# EAGLE board faout (EAGLE 7.1.0)
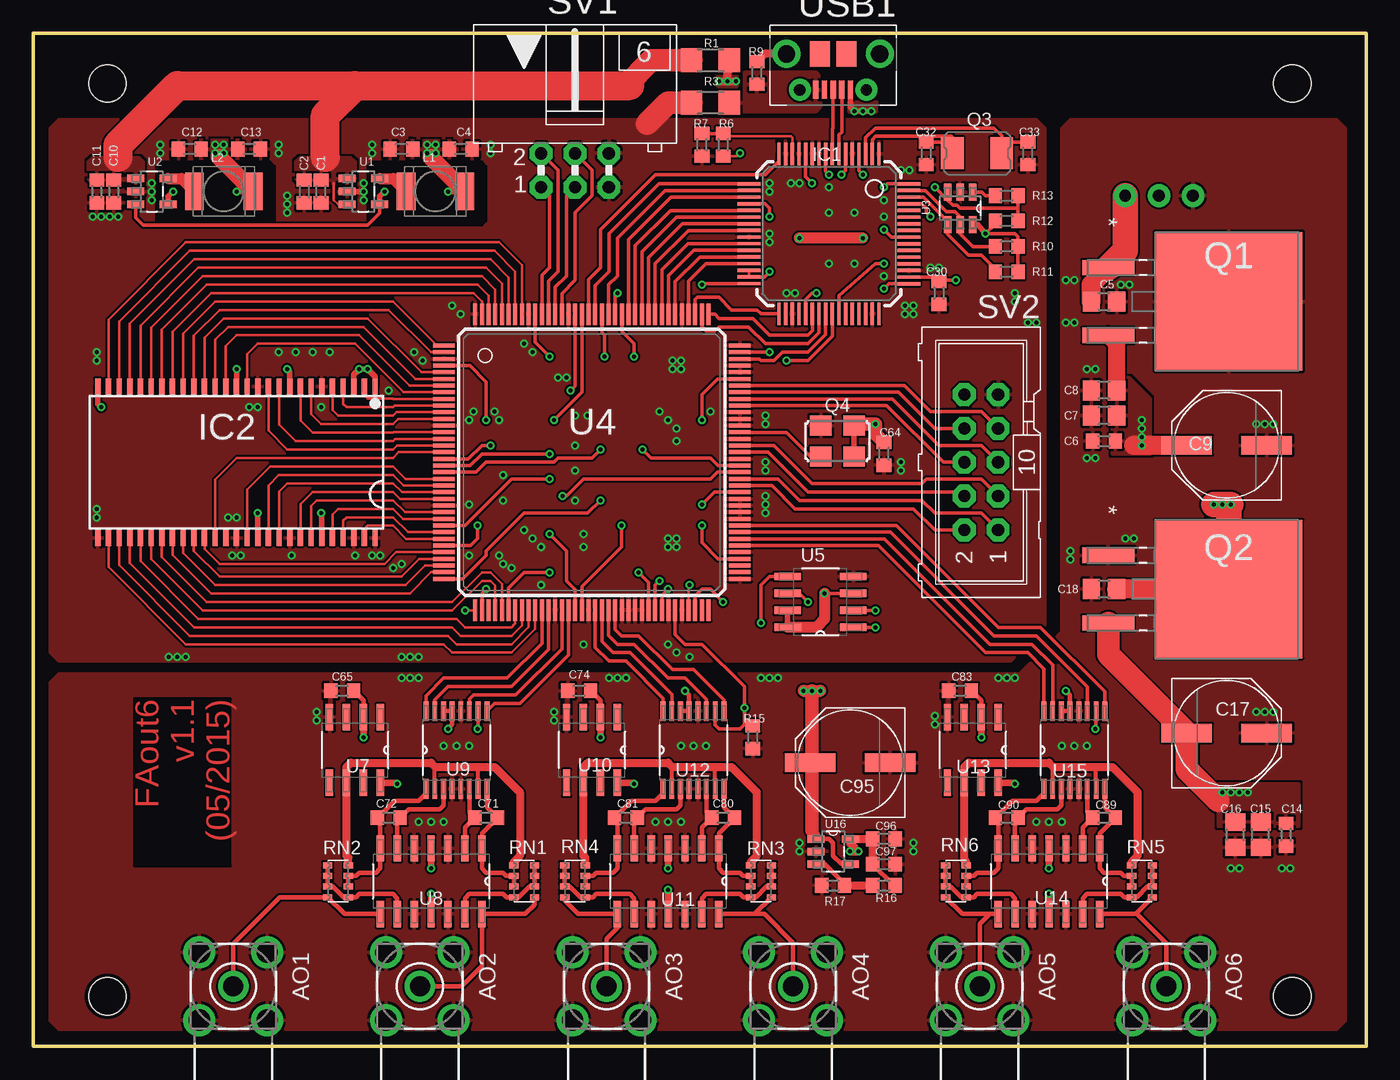
[diagram p1: board, top side]
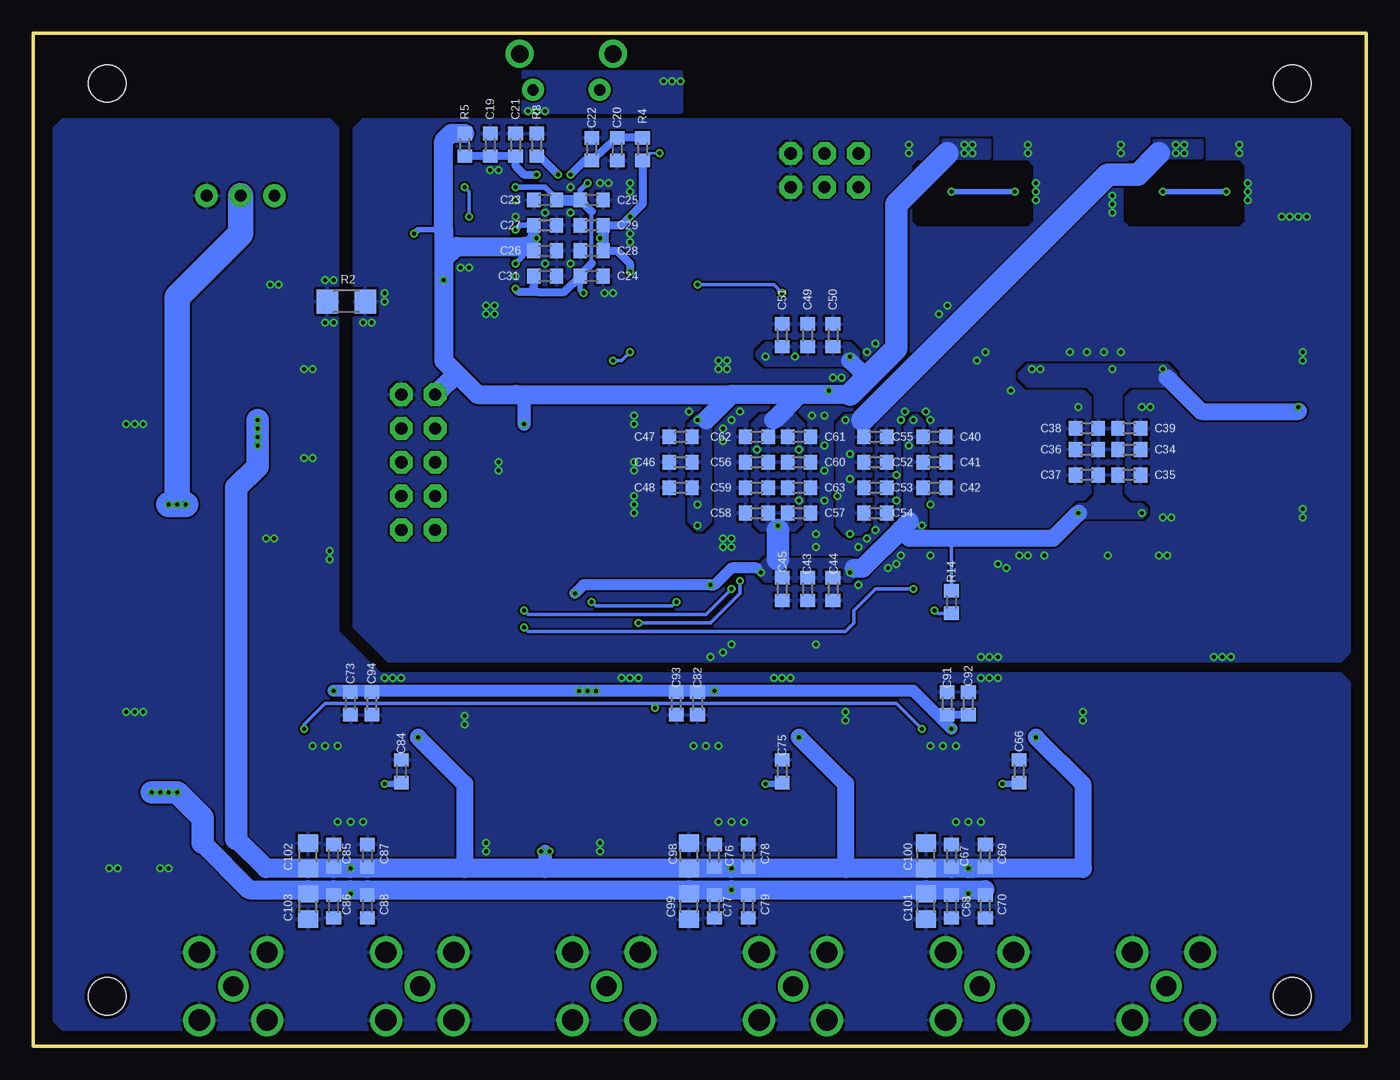
[diagram p2: board, bottom side, seen from below]

Size 100 x 76 mm. Coordinates in mm from the lower left corner, seen from the top.
Outline: 0,0 100,0 100,76 0,76 0,0
Copper layers (1*16): Top 0.035mm / dielectric 1.5mm / Bottom 0.035mm
Design rules "PCB-POOL Standard *": minimum track width 0.15mm, minimum drill 0.3mm, track to track 0.15mm, track to pad 0.15mm, pad to pad 0.15mm, via to via 0.15mm, smd to smd 0.15mm, copper to edge 0.3mm, drill to drill 0.2mm, minimum pad ring 0.4mm, minimum via ring 0.15mm, stop-mask expansion 0.075mm, vias tented up to drill 0.3mm, thermal gap 0.2mm
Net classes: 1 spaceing: clearance 0.5 mm
Holes 2.8 mm at 5.55,3.75 94.45,3.75 5.55,72.25 94.45,72.25

## Footprints (pad centres in the part's own frame; a part is rotated, then mirrored left to right if it is on the bottom)
BU-SMA-H = drill 1.5: 1 0,0 | drill 1.6: 2 -2.55,2.55; 3 2.55,2.55; 4 2.55,-2.55; 5 -2.55,-2.55
R0603 = smd 1 x 1.1: 1 -0.85,0; 2 0.85,0
R0805 = smd 1.3 x 1.5: 1 -0.95,0; 2 0.95,0
PANASONIC_E = smd 3.8 x 1.4: + 3,0; - -3,0
TQFP64-12X12 = smd 0.25 x 1.7: 1 -3.75,-6; 2 -3.25,-6; 3 -2.75,-6; 4 -2.25,-6; 5 -1.75,-6; 6 -1.25,-6; 7 -0.75,-6; 8 -0.25,-6; 9 0.25,-6; 10 0.75,-6; 11 1.25,-6; 12 1.75,-6; 13 2.25,-6; 14 2.75,-6; 15 3.25,-6; 16 3.75,-6; 33 3.75,6; 34 3.25,6; 35 2.75,6; 36 2.25,6; 37 1.75,6; 38 1.25,6; 39 0.75,6; 40 0.25,6; 41 -0.25,6; 42 -0.75,6; 43 -1.25,6; 44 -1.75,6; 45 -2.25,6; 46 -2.75,6; 47 -3.25,6; 48 -3.75,6 | smd 1.7 x 0.25: 17 6,-3.75; 18 6,-3.25; 19 6,-2.75; 20 6,-2.25; 21 6,-1.75; 22 6,-1.25; 23 6,-0.75; 24 6,-0.25; 25 6,0.25; 26 6,0.747; 27 6,1.247; 28 6,1.747; 29 6,2.247; 30 6,2.747; 31 6,3.247; 32 6,3.747; 49 -6,3.75; 50 -6,3.25; 51 -6,2.75; 52 -6,2.25; 53 -6,1.75; 54 -6,1.25; 55 -6,0.75; 56 -6,0.25; 57 -6,-0.25; 58 -6,-0.75; 59 -6,-1.25; 60 -6,-1.75; 61 -6,-2.25; 62 -6,-2.75; 63 -6,-3.25; 64 -6,-3.75
TSOP54-400 = smd 0.4 x 1.2: 1 -10.4,-5.68; 2 -9.6,-5.68; 3 -8.8,-5.68; 4 -8,-5.68; 5 -7.2,-5.68; 6 -6.4,-5.68; 7 -5.6,-5.68; 8 -4.8,-5.68; 9 -4,-5.68; 10 -3.2,-5.68; 11 -2.4,-5.68; 12 -1.6,-5.68; 13 -0.8,-5.68; 14 0,-5.68; 15 0.8,-5.68; 16 1.6,-5.68; 17 2.4,-5.68; 18 3.2,-5.68; 19 4,-5.68; 20 4.8,-5.68; 21 5.6,-5.68; 22 6.4,-5.68; 23 7.2,-5.68; 24 8,-5.68; 25 8.8,-5.68; 26 9.6,-5.68; 27 10.4,-5.68; 28 10.4,5.68; 29 9.6,5.68; 30 8.8,5.68; 31 8,5.68; 32 7.2,5.68; 33 6.4,5.68; 34 5.6,5.68; 35 4.8,5.68; 36 4,5.68; 37 3.2,5.68; 38 2.4,5.68; 39 1.6,5.68; 40 0.8,5.68; 41 0,5.68; 42 -0.8,5.68; 43 -1.6,5.68; 44 -2.4,5.68; 45 -3.2,5.68; 46 -4,5.68; 47 -4.8,5.68; 48 -5.6,5.68; 49 -6.4,5.68; 50 -7.2,5.68; 51 -8,5.68; 52 -8.8,5.68; 53 -9.6,5.68; 54 -10.4,5.68
L5038P = smd 1.4 x 2.8: 1 -2.2,0; 2 2.2,0
TE_CONN_MTE_HEADER3_R = drill 0.89: P$1 -2.54,0; P$2 0,0; P$3 2.54,0
TO254P1524X460-3N = smd 1.143 x 3.912: 1 -2.54,-8.89; 3 2.54,-8.89 | smd 10.389 x 11.049: 2 0,0.152
TXC_QUARTZ_7A = smd 1.7 x 2.4: 1 -1.85,0; 2 1.85,0
ASF = smd 1.6 x 1.5: 1 -1.25,-1.15; 2 1.25,-1.15; 3 1.25,1.15; 4 -1.25,1.15
R1206 = smd 1.6 x 1.803: 1 -1.422,0; 2 1.422,0
EXBV8V = smd 0.45 x 0.7: 1 -1.2,-0.775; 2 -0.4,-0.775; 3 0.4,-0.775; 4 1.2,-0.775; 5 1.2,0.775; 6 0.4,0.775; 7 -0.4,0.775; 8 -1.2,0.775
ML6L = drill 0.914 octagon: 1 -2.54,-1.27; 2 -2.54,1.27; 3 0,-1.27; 4 0,1.27; 5 2.54,-1.27; 6 2.54,1.27
ML10 = drill 0.914 octagon: 1 -5.08,-1.27; 2 -5.08,1.27; 3 -2.54,-1.27; 4 -2.54,1.27; 5 0,-1.27; 6 0,1.27; 7 2.54,-1.27; 8 2.54,1.27; 9 5.08,-1.27; 10 5.08,1.27
SOT95P284X122-5N = smd 1.27 x 0.559: 1 -1.219,0.965; 2 -1.219,0; 3 -1.219,-0.965; 4 1.219,-0.965; 5 1.219,0.965
SOT95P280X145-6N = smd 1.27 x 0.559: 1 -1.219,0.94; 2 -1.219,0; 3 -1.219,-0.94; 4 1.219,-0.94; 5 1.219,0; 6 1.219,0.94
TQ144 = smd 1.6 x 0.3: 1 -11.1,8.75; 2 -11.1,8.25; 3 -11.1,7.75; 4 -11.1,7.25; 5 -11.1,6.75; 6 -11.1,6.25; 7 -11.1,5.75; 8 -11.1,5.25; 9 -11.1,4.75; 10 -11.1,4.25; 11 -11.1,3.75; 12 -11.1,3.25; 13 -11.1,2.75; 14 -11.1,2.25; 15 -11.1,1.75; 16 -11.1,1.25; 17 -11.1,0.75; 18 -11.1,0.25; 19 -11.1,-0.25; 20 -11.1,-0.75; 21 -11.1,-1.25; 22 -11.1,-1.75; 23 -11.1,-2.25; 24 -11.1,-2.75; 25 -11.1,-3.25; 26 -11.1,-3.75; 27 -11.1,-4.25; 28 -11.1,-4.75; 29 -11.1,-5.25; 30 -11.1,-5.75; 31 -11.1,-6.25; 32 -11.1,-6.75; 33 -11.1,-7.25; 34 -11.1,-7.75; 35 -11.1,-8.25; 36 -11.1,-8.75; 73 11.1,-8.75; 74 11.1,-8.25; 75 11.1,-7.75; 76 11.1,-7.25; 77 11.1,-6.75; 78 11.1,-6.25; 79 11.1,-5.75; 80 11.1,-5.25; 81 11.1,-4.75; 82 11.1,-4.25; 83 11.1,-3.75; 84 11.1,-3.25; 85 11.1,-2.75; 86 11.1,-2.25; 87 11.1,-1.75; 88 11.1,-1.25; 89 11.1,-0.75; 90 11.1,-0.25; 91 11.1,0.25; 92 11.1,0.75; 93 11.1,1.25; 94 11.1,1.75; 95 11.1,2.25; 96 11.1,2.75; 97 11.1,3.25; 98 11.1,3.75; 99 11.1,4.25; 100 11.1,4.75; 101 11.1,5.25; 102 11.1,5.75; 103 11.1,6.25; 104 11.1,6.75; 105 11.1,7.25; 106 11.1,7.75; 107 11.1,8.25; 108 11.1,8.75 | smd 0.3 x 1.6: 37 -8.75,-11.1; 38 -8.25,-11.1; 39 -7.75,-11.1; 40 -7.25,-11.1; 41 -6.75,-11.1; 42 -6.25,-11.1; 43 -5.75,-11.1; 44 -5.25,-11.1; 45 -4.75,-11.1; 46 -4.25,-11.1; 47 -3.75,-11.1; 48 -3.25,-11.1; 49 -2.75,-11.1; 50 -2.25,-11.1; 51 -1.75,-11.1; 52 -1.25,-11.1; 53 -0.75,-11.1; 54 -0.25,-11.1; 55 0.25,-11.1; 56 0.75,-11.1; 57 1.25,-11.1; 58 1.75,-11.1; 59 2.25,-11.1; 60 2.75,-11.1; 61 3.25,-11.1; 62 3.75,-11.1; 63 4.25,-11.1; 64 4.75,-11.1; 65 5.25,-11.1; 66 5.75,-11.1; 67 6.25,-11.1; 68 6.75,-11.1; 69 7.25,-11.1; 70 7.75,-11.1; 71 8.25,-11.1; 72 8.75,-11.1; 109 8.75,11.1; 110 8.25,11.1; 111 7.75,11.1; 112 7.25,11.1; 113 6.75,11.1; 114 6.25,11.1; 115 5.75,11.1; 116 5.25,11.1; 117 4.75,11.1; 118 4.25,11.1; 119 3.75,11.1; 120 3.25,11.1; 121 2.75,11.1; 122 2.25,11.1; 123 1.75,11.1; 124 1.25,11.1; 125 0.75,11.1; 126 0.25,11.1; 127 -0.25,11.1; 128 -0.75,11.1; 129 -1.25,11.1; 130 -1.75,11.1; 131 -2.25,11.1; 132 -2.75,11.1; 133 -3.25,11.1; 134 -3.75,11.1; 135 -4.25,11.1; 136 -4.75,11.1; 137 -5.25,11.1; 138 -5.75,11.1; 139 -6.25,11.1; 140 -6.75,11.1; 141 -7.25,11.1; 142 -7.75,11.1; 143 -8.25,11.1; 144 -8.75,11.1
SOIC127P600X175-8N = smd 1.981 x 0.559: 1 -2.464,1.905; 2 -2.464,0.635; 3 -2.464,-0.635; 4 -2.464,-1.905; 5 2.464,-1.905; 6 2.464,-0.635; 7 2.464,0.635; 8 2.464,1.905
SOIC127P600X175-14N = smd 1.981 x 0.559: 1 -2.464,3.81; 2 -2.464,2.54; 3 -2.464,1.27; 4 -2.464,0; 5 -2.464,-1.27; 6 -2.464,-2.54; 7 -2.464,-3.81; 8 2.464,-3.81; 9 2.464,-2.54; 10 2.464,-1.27; 11 2.464,0; 12 2.464,1.27; 13 2.464,2.54; 14 2.464,3.81
SOP65P640X120-16N = smd 1.473 x 0.356: 1 -2.921,2.286; 2 -2.921,1.626; 3 -2.921,0.965; 4 -2.921,0.33; 5 -2.921,-0.33; 6 -2.921,-0.965; 7 -2.921,-1.626; 8 -2.921,-2.286; 9 2.921,-2.286; 10 2.921,-1.626; 11 2.921,-0.965; 12 2.921,-0.33; 13 2.921,0.33; 14 2.921,0.965; 15 2.921,1.626; 16 2.921,2.286
SOT95P300X120-5N = smd 1.27 x 0.559: 1 -1.295,0.94; 2 -1.295,0; 3 -1.295,-0.94; 4 1.295,-0.94; 5 1.295,0.94
MOLEX_105017-0001 = smd 0.4 x 1.35: 1 -1.3,0; 2 -0.65,0; 3 0,0; 4 0.65,0; 5 1.3,0 | drill 0.85 pad 1.45: M1 -2.5,0; M2 2.5,0 | drill 1.3 pad 1.9: M3 -3.5,-2.7; M6 3.5,-2.7 | smd 1.5 x 1.9: M4 -1,-2.7; M5 1,-2.7

## Placement (x,y rotation side)
AO1  BU-SMA  [BU-SMA-H]  15,4.5 270 top
AO2  BU-SMA  [BU-SMA-H]  29,4.5 270 top
AO3  BU-SMA  [BU-SMA-H]  43,4.5 270 top
AO4  BU-SMA  [BU-SMA-H]  57,4.5 270 top
AO5  BU-SMA  [BU-SMA-H]  71,4.5 270 top
AO6  BU-SMA  [BU-SMA-H]  85,4.5 270 top
C1  4.7uF  [R0603]  21.59,64.14 270 top
C2  4.7uF  [R0603]  20.32,64.14 270 top
C3  4.7uF  [R0603]  27.62,67.31 180 top
C4  4.7uF  [R0603]  32.07,67.31 0 top
C5  10uF  [R0805]  80.33,55.88 0 top
C6  100nF  [R0603]  80.33,45.4 180 top
C7  10uF  [R0805]  80.33,47.31 180 top
C8  10uF  [R0805]  80.33,49.21 180 top
C9  220uF  [PANASONIC_E]  89.53,45.09 180 top
C10  4.7uF  [R0603]  6.03,64.14 270 top
C11  4.7uF  [R0603]  4.76,64.14 270 top
C12  4.7uF  [R0603]  11.75,67.31 180 top
C13  4.7uF  [R0603]  16.19,67.31 0 top
C14  100nF  [R0603]  93.98,15.88 90 top
C15  10uF  [R0805]  92.08,15.88 90 top
C16  10uF  [R0805]  90.17,15.88 90 top
C17  220uF  [PANASONIC_E]  89.53,23.5 0 top
C18  10uF  [R0805]  80.33,34.29 180 top
C19  4.7uF  [R0603]  65.72,67.63 90 bottom
C20  4.7uF  [R0603]  56.2,67.31 270 bottom
C21  100nF  [R0603]  63.82,67.63 90 bottom
C22  100nF  [R0603]  58.1,67.31 90 bottom
C23  100nF  [R0603]  61.59,63.5 180 bottom
C24  100nF  [R0603]  58.1,57.78 0 bottom
C25  100nF  [R0603]  58.1,63.5 0 bottom
C26  100nF  [R0603]  61.59,59.69 0 bottom
C27  100nF  [R0603]  61.59,61.59 0 bottom
C28  100nF  [R0603]  58.1,59.69 180 bottom
C29  100nF  [R0603]  58.1,61.59 180 bottom
C30  100nF  [R0603]  67.94,56.52 270 top
C31  4.7uF  [R0603]  61.59,57.78 0 bottom
C32  18pF  [R0603]  66.99,66.99 270 top
C33  18pF  [R0603]  74.61,66.99 270 top
C34  470nF  [R0603]  17.78,44.77 0 bottom
C35  470nF  [R0603]  17.78,42.86 0 bottom
C36  4.7uF  [R0603]  20.95,44.77 180 bottom
C37  4.7uF  [R0603]  20.95,42.86 180 bottom
C38  10nF  [R0603]  20.95,46.35 180 bottom
C39  10nF  [R0603]  17.78,46.35 0 bottom
C40  470nF  [R0603]  32.38,45.72 0 bottom
C41  470nF  [R0603]  32.38,43.81 0 bottom
C42  4.7uF  [R0603]  32.38,41.91 0 bottom
C43  470nF  [R0603]  41.91,34.29 270 bottom
C44  470nF  [R0603]  40.01,34.29 270 bottom
C45  4.7uF  [R0603]  43.81,34.29 270 bottom
C46  470nF  [R0603]  51.44,43.81 180 bottom
C47  470nF  [R0603]  51.44,45.72 180 bottom
C48  4.7uF  [R0603]  51.44,41.91 180 bottom
C49  470nF  [R0603]  41.91,53.34 90 bottom
C50  470nF  [R0603]  40.01,53.34 90 bottom
C51  4.7uF  [R0603]  43.81,53.34 90 bottom
C52  470nF  [R0603]  36.83,43.81 0 bottom
C53  4.7uF  [R0603]  36.83,41.91 0 bottom
C54  4.7uF  [R0603]  36.83,40.01 0 bottom
C55  4.7uF  [R0603]  36.83,45.72 0 bottom
C56  470nF  [R0603]  45.72,43.81 180 bottom
C57  4.7uF  [R0603]  42.55,40.01 0 bottom
C58  4.7uF  [R0603]  45.72,40.01 180 bottom
C59  4.7uF  [R0603]  45.72,41.91 180 bottom
C60  4.7uF  [R0603]  42.55,43.81 0 bottom
C61  4.7uF  [R0603]  42.55,45.72 0 bottom
C62  4.7uF  [R0603]  45.72,45.72 180 bottom
C63  4.7uF  [R0603]  42.55,41.91 0 bottom
C64  10nF  [R0603]  63.82,44.45 270 top
C65  1uF  [R0603]  23.18,26.67 180 top
C66  1uF  [R0603]  26.04,20.64 90 bottom
C67  1uF  [R0603]  31.11,14.29 90 bottom
C68  1uF  [R0603]  31.11,10.48 90 bottom
C69  100nF  [R0603]  28.57,14.29 90 bottom
C70  100nF  [R0603]  28.57,10.48 90 bottom
C71  20pF  [R0603]  33.97,17.14 180 top
C72  20pF  [R0603]  26.67,17.14 0 top
C73  10nF  [R0603]  76.2,25.72 270 bottom
C74  1uF  [R0603]  40.96,26.67 180 top
C75  1uF  [R0603]  43.81,20.64 90 bottom
C76  1uF  [R0603]  48.9,14.29 90 bottom
C77  1uF  [R0603]  48.9,10.48 90 bottom
C78  100nF  [R0603]  46.35,14.29 90 bottom
C79  100nF  [R0603]  46.35,10.48 90 bottom
C80  20pF  [R0603]  51.75,17.14 180 top
C81  20pF  [R0603]  44.45,17.14 0 top
C82  10nF  [R0603]  50.16,25.72 270 bottom
C83  1uF  [R0603]  69.53,26.67 180 top
C84  1uF  [R0603]  72.39,20.64 90 bottom
C85  1uF  [R0603]  77.47,14.29 90 bottom
C86  1uF  [R0603]  77.47,10.48 90 bottom
C87  100nF  [R0603]  74.93,14.29 90 bottom
C88  100nF  [R0603]  74.93,10.48 90 bottom
C89  20pF  [R0603]  80.33,17.14 180 top
C90  20pF  [R0603]  73.03,17.14 0 top
C91  10nF  [R0603]  31.43,25.72 90 bottom
C92  1uF  [R0603]  29.84,25.72 90 bottom
C93  1uF  [R0603]  51.75,25.72 270 bottom
C94  1uF  [R0603]  74.61,25.72 270 bottom
C95  220uF  [PANASONIC_E]  61.28,21.27 180 top
C96  10nF  [R0603]  63.82,15.56 0 top
C97  1uF  [R0603]  63.82,13.65 0 top
C98  10uF  [R0805]  50.8,14.29 90 bottom
C99  10uF  [R0805]  50.8,10.48 90 bottom
C100  10uF  [R0805]  33.02,14.29 90 bottom
C101  10uF  [R0805]  33.02,10.48 90 bottom
C102  10uF  [R0805]  79.38,14.29 90 bottom
C103  10uF  [R0805]  79.38,10.48 90 bottom
IC1  [TQFP64-12X12]  59.69,60.96 180 top
IC2  MT48LC16M16A2  [TSOP54-400]  15.24,43.81 180 top
L1  2.2uH  [L5038P]  30.16,64.14 0 top
L2  2.2uH  [L5038P]  14.29,64.14 0 top
P1  TE_CONN_MTE_HEADER3R  [TE_CONN_MTE_HEADER3_R]  84.45,63.82 0 top
Q1  L7812CD2T-TR  [TO254P1524X460-3N]  89.53,55.88 270 top
Q2  L7912CD2T-TR  [TO254P1524X460-3N]  89.53,34.29 270 top
Q3  12MHz  [TXC_QUARTZ_7A]  70.8,66.99 0 top
Q4  ASFL  [ASF]  60.33,45.4 180 top
R1  ferrite  [R1206]  50.8,73.98 180 top
R2  ferrite  [R1206]  76.52,55.88 0 bottom
R3  ferrite  [R1206]  50.8,70.8 180 top
R4  ferrite  [R0603]  54.29,67.31 90 bottom
R5  ferrite  [R0603]  67.63,67.63 270 bottom
R6  10k  [R0603]  51.75,67.63 270 top
R7  NC  [R0603]  50.16,67.63 270 top
R8  12k  [R0603]  62.23,67.63 90 bottom
R9  [R0603]  54.29,73.03 270 top
R10  10k  [R0603]  73.03,60.01 0 top
R11  10k  [R0603]  73.03,58.1 0 top
R12  10k  [R0603]  73.03,61.91 180 top
R13  2.2k  [R0603]  73.03,63.82 180 top
R14  10k  [R0603]  31.11,33.34 90 bottom
R15  10k  [R0603]  53.98,23.18 270 top
R16  13k  [R0603]  63.82,12.06 180 top
R17  5.1k  [R0603]  60.01,12.06 180 top
RN1  10k  [EXBV8V]  36.83,12.38 270 top
RN2  10k  [EXBV8V]  22.86,12.38 270 top
RN3  10k  [EXBV8V]  54.61,12.38 270 top
RN4  10k  [EXBV8V]  40.64,12.38 270 top
RN5  10k  [EXBV8V]  83.19,12.38 270 top
RN6  10k  [EXBV8V]  69.22,12.38 270 top
SV1  [ML6L]  40.64,65.72 0 top
SV2  [ML10]  71.12,43.81 90 top
U1  LM3671MF-3.3  [SOT95P284X122-5N]  24.77,64.14 0 top
U2  LM3671MF-1.2  [SOT95P284X122-5N]  8.89,64.14 0 top
U3  93LC46BT-I/OT  [SOT95P280X145-6N]  69.53,62.87 270 top
U4  6SLX9TQG144  [TQ144]  41.91,43.81 0 top
U5  M25PE16SO8N  [SOIC127P600X175-8N]  59.05,33.34 180 top
U7  REF102AU  [SOIC127P600X175-8N]  24.13,22.23 270 top
U8  OPA4277UA  [SOIC127P600X175-14N]  29.84,12.38 270 top
U9  DAC8812  [SOP65P640X120-16N]  31.75,22.23 90 top
U10  REF102AU  [SOIC127P600X175-8N]  41.91,22.23 270 top
U11  OPA4277UA  [SOIC127P600X175-14N]  47.62,12.38 270 top
U12  DAC8812  [SOP65P640X120-16N]  49.53,22.23 90 top
U13  REF102AU  [SOIC127P600X175-8N]  70.48,22.23 270 top
U14  OPA4277UA  [SOIC127P600X175-14N]  76.2,12.38 270 top
U15  DAC8812  [SOP65P640X120-16N]  78.11,22.23 90 top
U16  LM7321MF  [SOT95P300X120-5N]  60.01,14.61 0 top
USB1  MOLEX_USB_105017-0001  [MOLEX_105017-0001]  60.01,71.75 180 top

## Tracks (layer width: path | path; a pad name or v marks a point on that pad's centre or on a via)
1V2  (via drill 0.3)
  Top 0.25: U4.89 51.32,43.06 50.8,42.55 41.27,42.55 40.01,41.27 v39.69,41.27 | U4.19 32.77,43.56 33.66,44.45 v38.73,44.45 | U4.28 32.4,39.06 35.88,42.55 v38.73,42.55 | U4.52 40.66,34.27 40.01,34.92 40.01,37.15 v38.73,38.42 | U4.128 41.16,49.1 v39.05,46.99
  Top 0.406: U2.4 10.11,63.77 v10.48,64.14 | v15.24,64.14 L2.2
  Top 1.27: L2.2 16.49,64.16 13.97,66.67
  Bottom 0.406: v10.48,64.14 v15.24,64.14
  Bottom 1.676: 37.78,46.99 19.37,65.41 17.14,65.41 15.56,66.99
  other vias: 14.29,67.63 14.29,66.99 13.65,67.63 13.65,66.99
  pour Bottom: 37.15,46.67 37.78,47.31 39.05,47.31 39.69,46.67 39.69,39.05 39.05,38.42 37.78,38.42 37.15,39.05
  pour Top: 15.88,66.67 15.88,67.94 12.38,67.94 12.38,66.67
  pour Bottom: 15.88,66.67 15.88,67.94 12.38,67.94 12.38,66.67
1V8  (via drill 0.3)
  Top 0.25: IC1.37 57.94,56.03 58.42,56.52 v58.74,56.52 | IC1.12 57.94,65.25 v58.42,64.77 | IC1.49 64.19,57.21 v63.82,56.83 | IC1.64 64.08,64.71 v63.82,64.45
  Bottom 0.25: C24.1 58.98,57.86 | C23.1 60.72,63.58
  Bottom 0.305: 58.1,58.74 58.1,62.62
  Bottom 0.406: C24.1 58.98,56.76 v58.74,56.52 | C25.1 58.98,64.21 v58.42,64.77 | 60.72,63.58 61.59,64.45 v63.82,64.45 | 62.47,56.91 62.15,56.59
  Bottom 0.61: 58.98,57.86 58.1,58.74 | 58.1,62.62 C25.1 | C24.1 60.17,56.59 62.15,56.59 63.58,56.59 v63.82,56.83 | C31.1 62.47,56.91
  Bottom 0.813: C23.1 C25.1
3V3  (via drill 0.3)
  Top 0.2: U4.69 49.16,34.55 v49.21,34.61 | IC1.30 IC1.31 | R6.2 52.81,66.78 v53.02,66.99
  Top 0.25: IC1.20 54.9,63.21 55.24,62.87 v55.24,62.23 | IC1.31 54.86,57.71 v55.24,58.1 | IC1.42 60.44,56.31 63.18,58.74 v63.82,58.74 | U4.135 37.66,52.83 v38.73,51.75 | U4.129 40.66,49.55 v40.32,49.21 | U4.76 51.38,36.56 50.16,37.78 v50.16,39.05 | U4.86 51.09,41.56 v50.16,40.64 | U4.90 51.37,43.56 50.8,44.13 46.35,44.13 v45.72,44.77 | U4.36 32.21,35.06 33.97,36.83 33.97,37.15 36.83,40.01 41.59,40.01 v42.55,40.96 | U4.31 32.8,37.56 33.34,38.1 v33.34,39.05 | U4.42 35.66,34.39 36.83,35.56 v38.73,35.56 | U4.53 41.16,34.49 44.13,37.47 v44.13,39.05 | U4.125 42.66,53.54 42.86,53.34 v42.86,51.75 | U4.122 44.16,53.63 45.09,52.7 v45.09,51.75 | U4.18 32.63,44.06 33.66,45.09 v34.29,45.09 | U4.20 33.22,43.06 33.97,43.81 39.05,43.81 39.37,44.13 41.91,44.13 v42.55,44.77 | U4.4 32.76,51.06 33.97,49.85 v33.97,46.99 | U4.63 46.16,34.8 v45.4,35.56 | U4.103 51.34,50.06 50.16,48.9 v50.16,46.99 | IC1.56 64.39,60.71 v63.82,61.28 | R12.2 72.17,61.7 v71.44,60.96 73.66,60.96 73.88,60.74 R10.2 R11.2 | IC1.50 67.6,57.71 C30.1 67.94,57.47 v69.22,57.47 | U2.3 7.67,62.18 8.26,61.59 25.08,61.59 25.98,62.5 U1.4 | U5.3 v59.37,33.97
  Top 0.35: 61.88,46.25 Q4.1
  Top 0.406: IC2.43 16.84,39.99 v16.83,40.01 | IC2.49 21.64,39.95 v21.59,40.01 | IC2.1 25.64,50.24 v25.08,50.8 v24.45,50.8 24.04,50.39 IC2.3 | IC2.9 19.24,50.61 v19.05,50.8 | IC2.14 v15.24,50.8 | Q4.4 Q4.1 | IC2.27 4.84,48.18 v5.08,47.94 | U3.6 70.85,61.65 v71.44,60.96 | U5.8 U5.7 | U1.4 25.98,63.77 v26.35,64.14 | v31.11,64.14 L1.2
  Top 0.813: v62.23,60.64 v57.47,60.64 | v59.37,33.97 59.37,32.07 58.74,31.43 U5.8
  Top 1.016: C64.1 63.18,45.94 v63.18,46.67 61.7,46.67 Q4.1
  Top 1.27: L1.2 32.36,64.16 29.84,66.67
  Bottom 0.2: 45.72,35.88 v45.4,35.56 | v40.32,49.21 40.32,48.9 | v53.02,66.99 53.76,66.99 R4.1
  Bottom 0.25: C26.1 62.87,59.69 | v69.22,57.47 69.22,58.1 | R14.2 31.11,37.47 31.75,38.1
  Bottom 0.35: 63.18,48.58 63.5,48.58
  Bottom 0.406: C27.1 63.5,61.59 v63.82,61.28 | v63.82,58.74 62.87,59.69 | v5.08,47.94 5.08,47.62 | v71.44,60.96 71.12,61.28 69.22,61.28 | v26.35,64.14 v31.11,64.14 | 63.18,48.58 63.82,48.9
  Bottom 0.61: C28.1 56.2,59.69 55.24,58.74 v55.24,58.1 | C29.1 55.88,61.59 v55.24,62.23 54.29,63.18 R4.1 | 62.47,60.64 v62.23,60.64 62.55,60.64 | v57.47,60.64 57.23,60.64
  Bottom 0.813: C26.1 62.47,60.64 C27.1 | C28.1 57.23,60.64 C29.1 | 62.55,60.64 63.18,60.01 | 45.72,35.88 47.62,35.88 48.9,34.61 v49.21,34.61 58.74,34.61 v59.37,33.97
  Bottom 1.016: 63.18,48.58 v63.18,46.67
  Bottom 1.27: 37.47,50.16 38.73,51.44 | 14.92,50.16 12.38,47.62 5.08,47.62 | 34.92,38.73 34.29,38.1 31.75,38.1 23.5,38.1 v21.59,40.01
  Bottom 1.422: 63.18,60.01 68.26,60.01 69.22,59.05 | 42.55,48.9 44.45,46.99 | 42.55,48.9 47.62,48.9 | 47.62,48.9 49.53,46.99 | 38.42,35.88 37.78,35.88 34.92,38.73 34.29,39.37 | 38.73,48.9 40.32,48.9 42.55,48.9 | 69.22,59.05 69.22,61.28 69.22,67.94 68.68,68.48 R5.1 | 69.22,59.05 69.22,58.1 69.22,51.44 68.26,50.48 | 68.26,50.48 66.67,48.9 63.82,48.9 47.62,48.9 | SV2.10 68.26,50.48
  Bottom 1.676: 44.13,38.73 44.13,36.51 | 38.73,48.9 37.47,50.16 35.24,52.39 35.24,63.18 31.43,66.99
  other vias: 29.53,67.63 30.16,67.63 30.16,66.99 29.53,66.99
  pour Bottom: 38.1,52.07 38.73,52.7 45.09,52.7 45.72,52.07 45.72,51.75 45.09,51.12 38.73,51.12 38.1,51.75
  pour Bottom: 49.85,38.73 49.21,39.37 49.21,46.67 49.85,47.31 50.16,47.31 50.8,46.67 50.8,39.37 50.16,38.73
  pour Bottom: 45.72,35.56 45.09,34.92 38.73,34.92 38.1,35.56 38.1,35.88 38.73,36.51 45.09,36.51 45.72,35.88
  pour Bottom: 33.97,47.31 34.61,46.67 34.61,39.05 33.97,38.42 33.66,38.42 33.02,39.05 33.02,46.67 33.66,47.31
  pour Bottom: 45.4,47.31 46.04,46.67 46.04,39.37 45.4,38.73 42.86,38.73 42.23,39.37 42.23,46.67 42.86,47.31
  pour Bottom: 26.04,50.48 25.4,51.12 14.92,51.12 14.29,50.48 14.29,50.16 14.92,49.53 17.78,49.53 18.41,48.9 18.41,41.27 17.78,40.64 16.83,40.64 16.51,40.32 16.51,40.01 16.83,39.69 21.59,39.69 21.91,40.01 21.91,40.32 21.59,40.64 20.95,40.64 20.32,41.27 20.32,48.9 20.95,49.53 25.4,49.53 26.04,50.16
  pour Bottom: 28.26,66.67 28.26,67.94 31.75,67.94 31.75,66.67
  pour Top: 28.26,66.67 28.26,67.94 31.75,67.94 31.75,66.67
5V0
  Top 0.2: U1.3 22.87,63.17 22.54,63.5 22.54,64.77
  Top 1.676: R1.2 46.35,73.98 44.45,72.07
  Top 2.184: 6.35,66.67 6.35,67.63 10.79,72.07 24.13,72.07 | 24.13,72.07 44.45,72.07 44.77,72.07 | 21.91,66.67 21.91,69.85 24.13,72.07
  pour Top: 7.94,64.77 4.45,64.77 4.13,65.09 4.13,66.36 4.45,66.67 7.94,66.67 8.26,66.36 8.26,65.09
  pour Top: 23.81,64.77 20,64.77 19.68,65.09 19.68,66.36 20,66.67 23.81,66.67 24.13,66.36 24.13,65.09
!DAC1_CS
  Top 0.25: U4.50 39.66,29.82 36.2,26.35 33.02,26.35 32.72,26.05 U9.11
!DAC1_LDAC
  Top 0.25: U4.48 38.66,29.77 35.88,26.99 31.11,26.99 30.12,26 U9.15
!DAC2_CS
  Top 0.25: U12.11 50.49,26.02 48.9,27.62 47.62,27.62 45.09,30.16 43.81,30.16 43.16,30.82 U4.57
!DAC2_LDAC
  Top 0.25: U12.15 47.9,26.39 44.77,29.53 43.5,29.53 42.66,30.36 U4.56
!DAC3_CS
  Top 0.25: U15.11 79.07,26.98 75.25,30.8 72.07,30.8 64.31,38.56 U4.80
!DAC3_LDAC
  Top 0.25: U15.15 76.48,28.61 74.93,30.16 71.75,30.16 63.85,38.06 U4.79
!DACX_RS  (via drill 0.3)
  Top 0.25: 53.34,24.13 v53.34,25.4 53.34,26.99 50.16,30.16 48.9,30.16 48.16,30.9 U4.67 | 53.34,24.13 53.02,23.81 51.44,23.81 51.16,24.09 U12.10 | U15.10 79.73,23.85 v79.69,23.81 | U9.10 33.38,23.85 v33.34,23.81 | 53.34,24.13 53.87,24.13 R15.1
  Bottom 0.25: v79.69,23.81 79.69,24.13 78.11,25.72 53.66,25.72 | 53.66,25.72 v53.34,25.4 | 53.66,25.72 35.24,25.72 v33.34,23.81
!RAM_CAS
  Top 0.2: U4.5 29.13,50.56 25.08,54.61 14.29,54.61 12.84,53.16 IC2.17
!RAM_RAS
  Top 0.2: U4.2 29.85,52.06 26.67,55.24 13.97,55.24 12.04,53.31 IC2.18
!RAM_WE
  Top 0.2: U4.6 28.68,50.06 24.77,53.98 14.61,53.98 13.64,53.01 IC2.16
!USB_OE
  Top 0.25: IC1.33 54.58,54.96 54.29,55.24 52.39,55.24 51.44,56.2 49.85,56.2 49.66,56.01 U4.111
!USB_RD
  Top 0.25: IC1.28 50.01,59.21 48.16,57.37 U4.114
!USB_RESET
  Top 0.2: IC1.14 56.94,68.16 56.83,68.26 52.28,68.26 R6.1
  Top 0.25: R6.1 R7.1
!USB_RXF
  Top 0.25: IC1.26 49.1,60.21 47.16,58.27 U4.116
!USB_TXE
  Top 0.25: IC1.27 49.55,59.71 47.66,57.82 U4.115
!USB_WR
  Top 0.25: IC1.29 50.46,58.71 49.16,57.41 U4.112
+15V
  Top 1.422: C5.1 79.38,57.15 Q1.1
  Top 1.93: P1.P$1 81.92,59.69 Q1.1
-15V  (via drill 0.3)
  Top 1.422: Q2.2 C18.1
  Top 1.93: v88.58,40.64 v89.22,40.64 | v89.22,40.64 v89.85,40.64 | Q2.2 89.69,40.17 v89.22,40.64
  Bottom 1.93: P1.P$2 84.45,60.96 89.22,56.2 v89.22,40.64 | v88.58,40.64 v89.85,40.64
A+3V3  (via drill 0.3)
  Top 0.35: v48.9,26.67 49.2,26.36 U12.13 U12.14 | U9.14 U9.13 31.42,24.14 v31.11,23.81 | v77.47,26.67 77.78,26.36 U15.13 U15.14 | U16.4 60.63,13.66 60.01,14.29 60.01,15.24 59.7,15.54 U16.1
  Top 0.61: U16.1 58.71,15.9 58.42,16.19
  Top 0.9: v57.78,26.67 v58.42,26.67 v59.05,26.67
  Top 1.016: C95.+ 58.42,21.27 | v58.42,26.67 58.42,21.41 C95.+ | 58.42,16.19 58.42,21.13 C95.+
  Bottom 0.61: C92.1 C91.1 31.91,24.87 31.91,24.61 | C93.1 51.75,26.67 | C82.1 50.16,26.67 | C94.1 74.61,26.67 | C73.1 76.2,26.67
  Bottom 0.9: v77.47,26.67 76.2,26.67 74.61,26.67 v59.05,26.67 v58.42,26.67 v57.78,26.67 51.75,26.67 50.16,26.67 v48.9,26.67 33.97,26.67 31.91,24.61 v31.11,23.81
A+12V  (via drill 0.3)
  Top 0.35: U7.2 24.77,25.93 C65.1 | U10.2 42.55,25.93 C74.1 | U13.2 71.12,25.93 C83.1 | R16.1 64.56,12.06 C97.1
  Top 0.5: U8.4 v29.84,13.34 | U7.2 v24.77,23.18 | U11.4 v47.62,13.34 | U10.2 v42.55,23.18 | U14.4 v76.2,13.34 | U13.2 v71.12,23.18
  Top 0.61: C97.1 C96.1 62.95,15.54 U16.5 61.3,15.21 61.59,14.92 61.59,14.61 | v61.28,14.61 61.59,14.61 | 61.59,14.61 v61.91,14.61
  Top 1.27: C8.1 81.28,52.71 Q1.3
  Top 1.422: C9.+ v83.19,45.09 82.55,45.09
  Bottom 0.3: C85.1 77.47,13.34 | C87.1 74.93,13.34 | C78.1 v47.62,13.34 C76.1 | C69.1 28.57,13.34 29.53,13.34 | C67.1 31.11,13.34
  Bottom 0.406: C100.1 | C98.1 | C102.1
  Bottom 0.61: v61.28,14.61 61.59,14.61 v61.91,14.61
  Bottom 1.016: 61.59,14.61 61.59,13.34
  Bottom 1.27: v24.77,23.18 21.27,19.68 21.27,13.34 | 39.05,13.34 39.05,19.68 v42.55,23.18 | 67.63,13.34 67.63,19.68 v71.12,23.18
  Bottom 1.422: 21.27,13.34 29.53,13.34 v29.84,13.34 31.11,13.34 C100.1 39.05,13.34 v47.62,13.34 C98.1 61.59,13.34 67.63,13.34 74.93,13.34 v76.2,13.34 77.47,13.34 C102.1 82.55,13.34 84.77,15.56
  Bottom 1.676: 84.77,15.56 84.77,41.91 83.19,43.5 v83.19,45.09 v83.19,45.72 v83.19,46.35 v83.19,46.99
  pour Top: 80.96,44.45 80.96,50.16 82.23,50.16 83.82,48.58 83.82,44.45
A-12V  (via drill 0.3)
  Top 0.5: U8.11 v29.84,11.43 | U11.11 v47.62,11.75 | U14.11 v76.2,11.43
  Top 1.676: Q2.3 80.64,29.39 C17.- 86.53,20.78 88.9,18.41
  Bottom 0.3: v76.2,11.43 76.2,11.75 | C88.2 74.93,11.75 | C86.2 77.47,11.75 | C77.2 v47.62,11.75 47.53,11.72 C79.2 | C68.2 28.57,11.75 | C70.2 v29.84,11.43
  Bottom 0.406: C101.2 33.02,11.75 | C99.2 50.8,11.75 | C103.2 79.38,11.75
  Bottom 0.5: 28.57,11.75 C70.2 | v47.62,11.75 47.31,11.62 47.53,11.72
  Bottom 1.422: 28.57,11.75 33.02,11.75 v47.62,11.75 50.8,11.75 74.93,11.75 76.2,11.75 77.47,11.75 79.38,11.75 83.82,11.75 87.31,15.24
  Bottom 1.676: 87.31,15.24 87.31,17.14 v89.22,19.05 v89.85,19.05 v90.49,19.05 v91.12,19.05
  pour Top: 94.93,16.51 88.9,16.51 88.9,19.68 94.93,19.68
AGND  (via drill 0.3)
  other vias: 46.67,16.83 47.62,16.83 48.58,16.83 28.89,16.83 29.84,16.83 30.8,16.83 75.25,16.83 76.2,16.83 77.15,16.83 30.8,22.54 31.75,22.54 32.7,22.54 49.53,22.54 50.48,22.54 48.58,22.54 78.11,22.54 79.06,22.54 77.15,22.54 57.47,15.24 57.47,14.61 67.63,24.77 67.63,24.13 39.05,24.45 39.05,25.08 21.27,25.08 21.27,24.45 28.89,27.62 28.26,27.62 27.62,27.62 73.66,27.62 73.03,27.62 72.39,27.62 54.61,27.62 55.24,27.62 55.88,27.62 43.81,27.62 43.18,27.62 44.45,27.62 78.11,54.29 78.11,57.47 77.47,57.47 77.47,54.29 92.39,25.08 91.76,25.08 93.03,25.08 66.04,15.24 66.04,14.61 92.39,46.67 91.76,46.67 93.03,46.67 79.69,50.8 79.06,50.8 90.49,13.34 93.66,13.34 82.23,57.15 81.6,57.15 79.69,44.13 79.06,44.13 94.3,13.34 89.85,13.34 81.92,38.1 82.55,38.1 77.79,37.15 77.79,36.51
  pour Top (rank 6): 1.27,1.91 1.27,27.3 1.91,27.94 73.98,27.94 77.15,31.11 77.15,68.9 77.79,69.53 97.79,69.53 98.42,68.9 98.42,1.91 97.79,1.27 1.91,1.27
  pour Bottom (rank 5): 1.27,1.91 1.27,27.3 1.91,27.94 73.98,27.94 77.15,31.11 77.15,68.9 77.79,69.53 97.79,69.53 98.42,68.9 98.42,1.91 97.79,1.27 1.91,1.27
CLK_IN
  Top 0.25: U4.95 53.04,46.04 56.52,46.04 58.3,44.25 Q4.3
DAC1_CLK
  Top 0.25: U4.47 38.16,30.22 35.56,27.62 30.8,27.62 29.46,26.29 U9.16
DAC1_IOUTA
  Top 0.3: 27.3,16.93 C72.2
  Top 0.35: U9.3 30.79,18.09 30.48,17.78 28.16,17.78 C72.2 | U8.6 27.3,16.93
DAC1_IOUTB
  Top 0.35: U9.6 32.72,17.55 C71.2 32.38,16.41 U8.2
DAC1_RFBA
  Top 0.3: 26.04,16.93 C72.1
  Top 0.35: U9.1 29.46,18.99 28.89,18.41 27.09,18.41 C72.1 | 26.04,16.93 U8.7 26.04,13.34 25.72,13.02 24.45,13.02 24.21,12.78 RN2.7 RN2.6
DAC1_RFBB
  Top 0.35: U9.8 34.04,17.93 C71.1 33.66,15.98 U8.1 33.66,13.34 33.97,13.02 35.24,13.02 35.48,12.78 RN1.2 RN1.3
DAC1_SDI
  Top 0.25: U4.51 40.16,29.36 36.51,25.72 34.61,25.72 U9.9
DAC1_VOUTA
  Top 0.35: U8.8 23.35,9.92 RN2.4 18.48,11.18 15,7.7 AO1.1
DAC1_VOUTB
  Top 0.35: AO2.1 32.12,4.5 33.66,6.03 U8.14 36.91,9.92 37.6,10.62 RN1.5
DAC1_VREF
  Top 0.3: U9.7 33.38,20.92 33.34,20.95 | U9.2 30.12,20.92 30.16,20.95
  Top 0.61: RN1.1 36.05,13.83 36.51,14.29 36.51,19.05 34.61,20.95 33.34,20.95 30.16,20.95 29.84,21.27 23.81,21.27 23.5,20.95 U7.6 23.5,14.29 23.64,14.15 RN2.8
DAC2_CLK
  Top 0.25: U12.16 47.24,26.1 44.45,28.89 43.18,28.89 42.16,29.91 U4.55
DAC2_IOUTA
  Top 0.3: 45.09,16.93 C81.2
  Top 0.35: U12.3 48.56,18.09 48.26,17.78 45.94,17.78 C81.2 | U11.6 45.09,16.93
DAC2_IOUTB
  Top 0.35: U12.6 50.49,17.55 C80.2 50.16,16.41 U11.2
DAC2_RFBA
  Top 0.3: 43.81,16.93 C81.1
  Top 0.35: U12.1 47.24,18.99 46.67,18.41 44.87,18.41 C81.1 | 43.81,16.93 U11.7 43.81,13.34 43.5,13.02 42.23,13.02 41.99,12.78 RN4.7 RN4.6
DAC2_RFBB
  Top 0.3: 51.44,13.97 U11.1
  Top 0.35: U12.8 51.82,17.93 C80.1 51.44,15.98 U11.1 | RN3.3 RN3.2 53.26,12.78 53.02,13.02 51.75,13.02 51.44,13.34 51.44,13.97
DAC2_SDI
  Top 0.25: U12.9 51.82,25.97 49.53,28.26 47.94,28.26 45.4,30.8 44.13,30.8 43.66,31.27 U4.58
DAC2_VOUTA
  Top 0.35: AO3.1 43,8.07 43.81,8.89 U11.8 40.88,9.92 39.87,10.94 RN4.4
DAC2_VOUTB
  Top 0.35: U11.14 54.12,9.92 | 54.12,9.92 RN3.5 | AO4.1 57,7.77 54.85,9.92 54.12,9.92
DAC2_VREF
  Top 0.3: U12.7 51.16,20.92 51.12,20.95 | U12.2 47.9,20.92 47.94,20.95
  Top 0.61: RN3.1 53.84,13.83 54.29,14.29 54.29,19.05 52.39,20.95 51.12,20.95 47.94,20.95 47.62,21.27 41.59,21.27 41.27,20.95 U10.6 41.27,14.29 41.41,14.15 RN4.8
DAC3_CLK
  Top 0.25: U15.16 75.82,28.32 74.61,29.53 71.44,29.53 63.4,37.56 U4.78
DAC3_IOUTA
  Top 0.3: 73.66,16.93 C90.2
  Top 0.35: U15.3 77.14,18.09 76.83,17.78 74.51,17.78 C90.2 | U14.6 73.66,16.93
DAC3_IOUTB
  Top 0.35: U15.6 79.07,17.55 C89.2 78.74,16.41 U14.2
DAC3_RFBA
  Top 0.35: U15.1 75.82,18.99 75.25,18.41 73.44,18.41 C90.1 72.39,16.93 U14.7 72.39,13.34 72.07,13.02 70.8,13.02 70.57,12.78 RN6.7 RN6.6
DAC3_RFBB
  Top 0.35: U15.8 80.39,17.93 C89.1 80.01,15.98 U14.1 80.01,13.34 80.33,13.02 81.6,13.02 81.83,12.78 RN5.2 RN5.3
DAC3_SDI
  Top 0.25: U15.9 80.39,26.61 75.56,31.43 72.39,31.43 64.76,39.06 U4.81
DAC3_VOUTA
  Top 0.35: U14.8 71.75,9.92 | AO5.1 71,9.16 71.75,9.92 | 71.75,9.92 69.7,9.92 RN6.4
DAC3_VOUTB
  Top 0.35: AO6.1 85,7.71 82.74,9.97 | U14.14 82.7,9.92 82.74,9.97 | 82.74,9.97 RN5.5
DAC3_VREF
  Top 0.3: U15.7 79.73,20.92 79.69,20.95 | U15.2 76.48,20.92 76.52,20.95
  Top 0.61: RN6.8 69.99,13.83 69.85,13.97 U13.6 69.85,20.95 70.17,21.27 76.2,21.27 76.52,20.95 79.69,20.95 80.96,20.95 82.87,19.05 82.87,14.29 82.41,13.83 RN5.1
EECS
  Top 0.25: IC1.63 66.92,64.21 68.5,62.62 69.14,62.62 69.53,62.23 U3.5 69.53,60.96 70.48,60.01 R10.1
EEDATA  (via drill 0.3)
  Top 0.25: U3.3 68.59,63.49 | 68.59,63.49 68.98,63.11 69.29,63.11 69.53,62.87 73.88,62.87 | R12.1 73.88,62.87 | 73.88,62.87 R13.1 | 68.59,63.49 v67.63,64.45 | IC1.61 66.65,63.21 66.99,62.87 66.99,62.55 v67.31,62.23
  Bottom 0.25: v67.63,64.45 67.31,64.14 v67.31,62.23
EESK
  Top 0.25: IC1.62 66.78,63.71 68.59,61.9 U3.4 68.59,60.95 70.17,59.37 71.12,59.37 72.17,58.32 R11.1
FLASH_CS  (via drill 0.3)
  Top 0.25: U4.38 33.66,33.98 v33.97,34.29 | U5.1 v63.18,31.43
  Bottom 0.25: v33.97,34.29 36.83,34.29 38.42,32.7 38.42,31.75 39.05,31.11 62.87,31.11 v63.18,31.43
FLASH_MISO  (via drill 0.3)
  Top 0.25: U4.65 47.16,33.83 v47.62,34.29 | v63.18,32.7 U5.2
  Bottom 0.25: v47.62,34.29 49.53,32.38 62.87,32.38 v63.18,32.7
FLASH_MOSI  (via drill 0.3)
  Top 0.25: U4.64 46.66,34.59 v46.99,34.92 | v54.61,31.75 54.61,34.61 55.24,35.24 U5.5
  Bottom 0.25: v46.99,34.92 46.99,33.97 49.21,31.75 v54.61,31.75
FLASH_SCK  (via drill 0.3)
  Top 0.25: U4.70 49.66,33.78 50.16,34.29 50.8,34.29 v51.75,33.34 | v58.1,33.34 57.47,33.97 U5.6
  Bottom 0.25: v51.75,33.34 52.07,33.02 57.78,33.02 v58.1,33.34
GND  (via drill 0.3)
  Top 0.4: U1.2 v24.77,64.14
  Top 1.676: R3.2 47.62,70.8 46.04,69.22
  other vias: 75.25,54.29 57.15,56.52 57.47,64.77 55.24,60.96 65.41,54.93 55.24,64.77 35.88,35.88 34.92,36.83 35.24,36.2 47.94,50.8 48.58,50.8 48.58,51.44 47.62,37.47 48.26,38.1 47.62,38.1 48.26,37.47 38.1,37.47 37.47,38.1 36.83,38.73 41.27,37.47 46.99,47.62 47.62,46.99 48.26,46.35 34.61,47.62 33.02,47.62 36.83,52.7 37.47,52.07 39.37,50.16 40.01,50.16 34.92,46.99 40.64,45.09 40.64,43.18 35.24,42.86 35.24,40.96 40.64,40.96 32.7,40.64 40.64,47.31 41.59,47.31 41.27,38.42 25.4,36.83 24.13,36.83 26.04,36.83 15.56,36.83 19.37,36.83 14.92,36.83 15.24,39.69 14.61,39.69 21.59,47.94 18.41,52.07 20.95,52.07 16.83,47.94 4.76,39.69 22.23,52.07 19.68,52.07 4.76,52.07 73.66,56.52 28.57,52.07 29.21,51.44 32.7,46.99 38.1,34.61 63.82,62.23 63.82,57.78 26.67,49.21 63.82,63.5 59.69,58.74 61.59,58.74 61.59,62.55 59.69,62.55 56.83,64.77 55.24,64.14 65.09,65.72 59.69,64.45 54.93,46.67 50.8,47.62 8.89,63.5 24.77,63.5 24.77,64.77 8.89,64.77 65.72,65.72 67.94,58.42 67.31,58.42 66.04,55.56 56.52,56.52 55.24,60.33 47.94,51.44 66.04,54.93 65.41,55.56 5.08,62.23 4.45,62.23 8.89,64.14 4.76,51.44 4.76,40.32 16.19,47.94 73.66,55.88 74.61,54.29 32.07,54.93 31.43,55.56 48.26,45.4 28.89,29.21 28.26,29.21 27.62,29.21 11.43,29.21 10.79,29.21 10.16,29.21 9.53,66.99 9.53,67.63 18.41,67.63 18.41,66.99 25.4,67.63 25.4,66.99 34.29,67.63 34.29,66.99 19.05,63.18 19.05,62.55 5.71,62.23 6.35,62.23 19.05,63.82 54.93,43.81 54.93,43.18 54.93,40.01 54.93,41.27 54.93,40.64 54.93,47.31 65.09,43.18 65.09,43.81 41.27,30.16 47.62,30.16 48.26,29.53 49.21,29.21 32.7,36.83 27.62,36.2 26.99,35.88
  pour Top (rank 6): 1.91,28.89 73.34,28.89 75.88,31.43 75.88,68.9 75.25,69.53 1.91,69.53 1.27,68.9 1.27,29.53
  pour Bottom (rank 6): 1.91,28.89 73.34,28.89 75.88,31.43 75.88,68.9 75.25,69.53 1.91,69.53 1.27,68.9 1.27,29.53
  cutout Top: 9.53,66.36 9.21,66.04 9.21,61.91 9.53,61.59 17.78,61.59 18.1,61.91 18.1,66.04 17.78,66.36
  cutout Bottom: 9.53,66.36 9.21,66.04 9.21,61.91 9.53,61.59 17.78,61.59 18.1,61.91 18.1,66.04 17.78,66.36
  cutout Bottom: 25.4,66.36 25.08,66.04 25.08,61.91 25.4,61.59 33.66,61.59 33.97,61.91 33.97,66.04 33.66,66.36
  cutout Top: 25.4,66.36 25.08,66.04 25.08,61.91 25.4,61.59 33.66,61.59 33.97,61.91 33.97,66.04 33.66,66.36
GPIO_0_0
  Top 0.25: U4.134 38.16,57.84 38.73,58.42 38.73,63.82 SV1.1
GPIO_0_1
  Top 0.25: U4.133 38.66,57.39 39.37,58.1 39.37,65.72 SV1.2
GPIO_0_2
  Top 0.25: U4.132 39.16,56.94 40.01,57.78 40.01,63.82 SV1.3
GPIO_0_3
  Top 0.25: U4.131 39.66,56.49 40.64,57.47 40.64,62.55 41.91,63.82 41.91,65.72 SV1.4
N$1
  Top 0.25: IC1.2 62.94,68.02 63.18,68.26 68.9,68.26 68.95,68.21 Q3.1 68.1,67.84 C32.1
N$2
  Top 0.25: IC1.3 62.44,68.16 63.18,68.9 72.07,68.9 72.65,68.32 Q3.2 73.5,67.84 C33.1
N$4  (via drill 0.3)
  Top 0.5: U7.8 27.23,19.76 v27.3,19.68
  Bottom 0.5: v27.3,19.68 26.14,19.68 C66.1
N$5  (via drill 0.3)
  Top 0.25: IC1.4 61.94,65.69 v62.23,65.41
  Bottom 0.61: R5.2 C19.1 C21.1 63.82,66.04 63.18,65.41 v62.23,65.41
N$6
  Top 0.25: U3.1 71.17,64.08 71.44,63.82 R13.2
N$7  (via drill 0.3)
  Top 0.25: IC1.9 59.44,65.66 v59.69,65.41
  Bottom 0.61: R4.2 C20.1 C22.1 58.63,66.46 v59.69,65.41
N$8
  Top 0.35: RN2.1 RN2.2 RN2.3 22.47,11.98 23.27,11.18 RN2.5 24.2,11.18 24.45,11.43 26.99,11.43 27.3,11.11 U8.9
N$9
  Top 0.35: RN4.1 RN4.2 RN4.3 40.25,11.98 41.05,11.18 RN4.5 41.98,11.18 42.23,11.43 44.77,11.43 45.09,11.11 U11.9
N$10
  Top 0.35: RN5.8 RN5.7 RN5.6 83.58,11.98 82.78,11.18 RN5.4 81.84,11.18 81.6,11.43 79.06,11.43 78.74,11.11 U14.13
N$11  (via drill 0.3)
  Top 0.5: U10.8 45.01,19.76 v45.09,19.68
  Bottom 0.5: v45.09,19.68 43.92,19.68 C75.1
N$12  (via drill 0.3)
  Top 0.5: U13.8 73.58,19.76 v73.66,19.68
  Bottom 0.5: v73.66,19.68 72.49,19.68 C84.1
N$13
  Top 0.35: U16.3 59.36,13.66 60.86,12.17 R17.1
  Top 0.61: R17.1 R16.2
N$14
  Top 0.35: U14.9 73.66,11.11 73.34,11.43 70.8,11.43 70.56,11.18 RN6.5 69.62,11.18 68.82,11.98 RN6.3 RN6.2 RN6.1
N$15
  Top 0.61: USB1.M6 54.87,74.45 R9.1
N$16
  Top 0.35: RN1.8 RN1.7 RN1.6 37.22,11.98 36.42,11.18 RN1.4 35.49,11.18 35.24,11.43 32.7,11.43 32.38,11.11 U8.13
N$17
  Top 0.35: RN3.8 RN3.7 RN3.6 55,11.98 54.2,11.18 RN3.4 53.27,11.18 53.02,11.43 50.48,11.43 50.16,11.11 U11.13
N$24
  Top 0.813: U1.5 27,65.1 L1.1
N$25
  Top 0.813: U2.5 11.12,65.1 L2.1
P1_0
  Top 0.25: U4.88 55.86,42.56 57.47,40.96 66.67,40.96 67.63,40.01 71.12,40.01 SV2.1
P1_1
  Top 0.25: U4.87 55.41,42.06 57.15,40.32 66.04,40.32 67.63,38.73 SV2.2
P1_2
  Top 0.25: U4.93 55.58,45.06 58.42,42.23 66.67,42.23 66.99,42.55 71.12,42.55 SV2.3
P1_3
  Top 0.25: U4.92 55.13,44.56 58.1,41.59 69.53,41.59 SV2.4
P1_4
  Top 0.25: U4.100 64.47,48.56 67.94,45.09 71.12,45.09 SV2.5
P1_5
  Top 0.25: U4.99 64.01,48.06 68.26,43.81 SV2.6
P1_6
  Top 0.25: U4.102 65.37,49.56 67.31,47.62 71.12,47.62 SV2.7
P1_7
  Top 0.25: U4.101 64.92,49.06 67.63,46.35 SV2.8
RAM_A0
  Top 0.2: U4.140 35.16,57.23 33.97,58.42 12.38,58.42 8.04,54.08 IC2.23
RAM_A1
  Top 0.2: U4.139 35.66,57.69 34.29,59.05 12.06,59.05 7.24,54.23 IC2.24
RAM_A2
  Top 0.2: U4.138 36.16,58.14 34.61,59.69 11.75,59.69 6.44,54.38 IC2.25
RAM_A3
  Top 0.2: U4.137 36.66,58.59 34.92,60.33 11.43,60.33 5.64,54.53 IC2.26
RAM_A4
  Top 0.2: U4.46 37.66,31.31 35.88,29.53 31.43,29.53 30.8,30.16 11.43,30.16 5.64,35.95 IC2.29
RAM_A5
  Top 0.2: U4.45 37.16,31.45 35.88,30.16 31.75,30.16 31.11,30.8 11.75,30.8 6.44,36.1 IC2.30
RAM_A6
  Top 0.2: U4.44 36.66,31.58 35.88,30.8 32.07,30.8 31.43,31.43 12.06,31.43 7.24,36.26 IC2.31
RAM_A7
  Top 0.2: U4.43 36.16,31.71 35.88,31.43 32.38,31.43 31.75,32.07 12.38,32.07 8.04,36.41 IC2.32
RAM_A8
  Top 0.2: IC2.33 8.84,36.56 12.7,32.7 31.43,32.7 33.66,34.92 34.29,34.92 34.66,34.55 U4.40
RAM_A9
  Top 0.2: IC2.34 9.64,36.72 13.02,33.34 31.43,33.34 33.66,35.56 34.29,35.56 35.16,34.69 U4.41
RAM_A10
  Top 0.2: U4.141 34.66,56.78 33.66,57.78 12.7,57.78 8.84,53.92 IC2.22
RAM_A11
  Top 0.2: U4.35 29.85,35.56 28.26,33.97 13.34,33.97 10.44,36.87 IC2.35
RAM_A12
  Top 0.2: IC2.36 11.24,37.02 13.65,34.61 27.94,34.61 29.4,36.06 U4.34
RAM_BA0
  Top 0.2: U4.143 33.66,55.88 33.02,56.52 13.34,56.52 10.44,53.62 IC2.20
RAM_BA1
  Top 0.2: U4.142 34.16,56.33 33.34,57.15 13.02,57.15 9.64,53.77 IC2.21
RAM_CKE
  Top 0.2: U4.33 28.95,36.56 27.62,35.24 13.97,35.24 12.04,37.17 IC2.37
RAM_CLK
  Top 0.2: U4.32 27.22,37.06 26.35,36.2 13.97,36.2 12.84,37.33 IC2.38
RAM_CS
  Top 0.2: U4.1 30.3,52.56 26.99,55.88 13.65,55.88 11.24,53.47 IC2.19
RAM_DQ0
  Top 0.2: IC2.2 24.84,48.82 25.08,48.58 26.99,48.58 27,48.56 U4.9
RAM_DQ1
  Top 0.2: IC2.4 23.24,48.2 23.5,47.94 26.99,47.94 27.11,48.06 U4.10
RAM_DQ2
  Top 0.2: IC2.5 22.44,47.73 22.86,47.31 26.99,47.31 27.25,47.56 U4.11
RAM_DQ3
  Top 0.2: IC2.7 20.84,47.42 21.59,46.67 26.99,46.67 27.38,47.06 U4.12
RAM_DQ4
  Top 0.2: IC2.8 20.04,46.95 20.95,46.04 26.99,46.04 27.02,46.06 U4.14
RAM_DQ5
  Top 0.2: IC2.10 18.44,46.65 19.68,45.4 26.99,45.4 27.15,45.56 U4.15
RAM_DQ6
  Top 0.2: IC2.11 17.64,46.18 19.05,44.77 26.99,44.77 27.29,45.06 U4.16
RAM_DQ7
  Top 0.2: U4.8 27.77,49.06 24.13,52.7 16.83,52.7 16.04,51.92 IC2.13
RAM_DQ8
  Top 0.2: IC2.42 16.04,41.76 17.78,43.5 26.99,43.5 27.92,42.56 U4.21
RAM_DQ9
  Top 0.2: IC2.44 17.64,42.09 18.41,42.86 26.99,42.86 27.79,42.06 U4.22
RAM_DQ10
  Top 0.2: IC2.45 18.44,41.62 19.05,42.23 26.99,42.23 27.65,41.56 U4.23
RAM_DQ11
  Top 0.2: IC2.47 20.04,40.68 20.95,41.59 26.99,41.59 27.52,41.06 U4.24
RAM_DQ12
  Top 0.2: IC2.48 20.84,40.52 21.27,40.96 26.99,40.96 27.88,40.06 U4.26
RAM_DQ13
  Top 0.2: IC2.50 22.44,39.9 22.86,40.32 26.99,40.32 27.75,39.56 U4.27
RAM_DQ14
  Top 0.2: IC2.51 23.24,39.43 23.5,39.69 26.99,39.69 28.11,38.56 U4.29
RAM_DQ15
  Top 0.2: IC2.53 24.84,38.81 25.08,39.05 26.99,39.05 27.98,38.06 U4.30
RAM_DQMH
  Top 0.2: IC2.39 13.64,42.53 15.24,44.13 26.99,44.13 27.42,44.56 U4.17
RAM_DQML
  Top 0.2: U4.7 28.22,49.56 24.45,53.34 15.24,53.34 14.44,52.54 IC2.15
RESET  (via drill 0.3)
  Top 0.2: v32.38,32.7 33.15,32.7 U4.37
  Bottom 0.25: R14.1 32.17,32.49 v32.38,32.7
TCK
  Top 0.2: U4.109 50.66,55.42
  Top 0.25: IC1.38 58.44,53.68 58.1,53.34 55.24,53.34 53.98,54.61 51.44,54.61 51.13,54.91 U4.109
TDI
  Top 0.25: IC1.39 58.94,53.54 58.1,52.7 54.93,52.7 53.66,53.98 51.44,53.98 51.12,53.66 50.48,53.66 50.16,53.98 U4.110
TDO
  Top 0.25: IC1.40 59.44,53.41 58.1,52.07 56.2,52.07 55.56,51.44 54.61,51.44 54.48,51.56 U4.106
TMS  (via drill 0.3)
  Top 0.25: IC1.41 59.94,53.27 58.1,51.44 v56.52,51.44 | v55.24,52.07 U4.107
  Bottom 0.25: v55.24,52.07 55.88,51.44 v56.52,51.44
USB_CLKOUT  (via drill 0.3)
  Top 0.25: v43.81,56.52 43.66,56.36 U4.123 | IC1.32 50.23,57.21 v50.16,57.15
  Bottom 0.25: v50.16,57.15 44.45,57.15 v43.81,56.52
USB_D0
  Top 0.25: IC1.16 55.94,66.42 54.93,65.41 46.67,65.41 42.55,61.28 42.55,58.42 41.66,57.53 U4.127
USB_D1
  Top 0.25: IC1.17 46.93,64.71 43.18,60.96 43.18,58.1 42.16,57.08 U4.126
USB_D2
  Top 0.25: IC1.18 47.38,64.21 43.81,60.64 43.81,57.78 43.16,57.13 U4.124
USB_D3
  Top 0.25: U4.121 44.66,60.53 47.84,63.71 IC1.19
USB_D4
  Top 0.25: U4.120 45.16,60.08 47.79,62.71 IC1.21
USB_D5
  Top 0.25: U4.119 45.66,59.63 48.24,62.21 IC1.22
USB_D6
  Top 0.25: U4.118 46.16,59.18 48.69,61.71 IC1.23
USB_D7
  Top 0.25: U4.117 46.66,58.73 49.15,61.21 IC1.24
USB_DM
  Top 0.254: IC1.7 60.44,68.38 60.66,68.59 USB1.2
USB_DP
  Top 0.254: IC1.8 59.94,68.83 60.01,68.9 USB1.3
USB_GND
  pour Top: 53.34,73.03 53.34,71.44 52.07,71.44 51.75,71.12 51.75,70.48 52.07,70.17 58.74,70.17 59.05,70.48 59.05,72.71 58.74,73.03
USB_REF  (via drill 0.3)
  Top 0.25: IC1.6 60.94,65.7 v60.64,65.41
  Bottom 0.25: R8.1 62.02,66.78
  Bottom 0.61: 62.02,66.78 v60.64,65.41
USB_V  (via drill 0.3)
  Top 0.4: USB1.1 61.31,70.45 v61.59,70.17
  Top 0.406: v62.87,70.17 v62.23,70.17 v61.59,70.17
  Top 0.61: v52.07,72.39 52.07,73.81 R1.1 | v51.44,72.39 v52.07,72.39 | v52.07,72.39 v52.7,72.39
  pour Bottom: 51.44,73.03 51.44,70.17 63.18,70.17 63.18,73.03
  pour Top: 61.28,71.12 61.28,70.17 63.18,70.17 63.18,71.12
  pour Top: 51.44,73.03 51.44,72.07 52.7,72.07 52.7,73.03

## Text on the board
Top: FAout6 / v1.1 / (05/2015)
tStop: FAout6 / v1.1 / (05/2015)